# Altium schematic sheet Block digram.SchDoc: Block diagram
size A4; Date: 3-7-2020; Author: Tim Chien; DrawnBy: Tim Chien; DocumentNumber: 1; Revision: 1-1; SheetNumber: 1; SheetTotal: 6; Time: 23:47
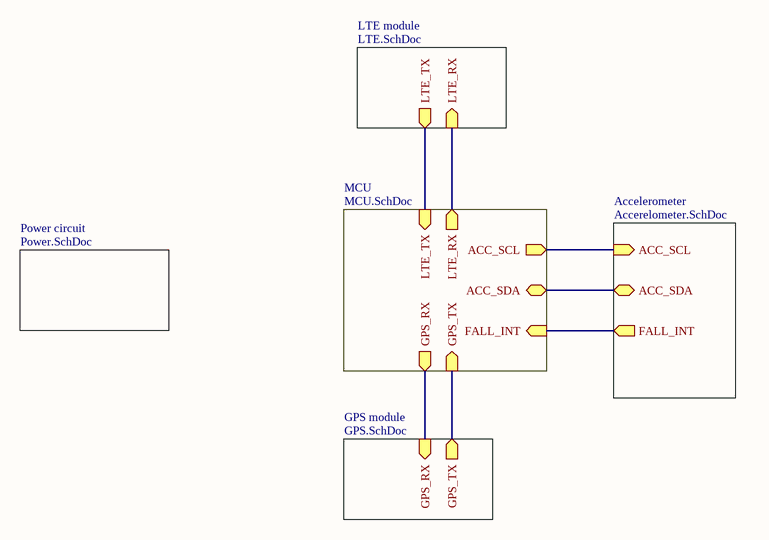
[diagram p0: Block digram.SchDoc]

## Sub-sheets
Accelerometer = Accerelometer.SchDoc: ACC_SCL (in), ACC_SDA (bidir), FALL_INT (out)
GPS module = GPS.SchDoc: GPS_TX (out), GPS_RX (in)
LTE module = LTE.SchDoc: LTE_TX (out), LTE_RX (in)
MCU = MCU.SchDoc: GPS_RX (out), GPS_TX (in), ACC_SCL (out), ACC_SDA (bidir), FALL_INT (in), LTE_TX (in), LTE_RX (out)
Power circuit = Power.SchDoc: no entries

## Nets
(unnamed): sheet Accelerometer/ACC_SCL, sheet MCU/ACC_SCL
(unnamed): sheet Accelerometer/ACC_SDA, sheet MCU/ACC_SDA
(unnamed): sheet Accelerometer/FALL_INT, sheet MCU/FALL_INT
(unnamed): sheet GPS module/GPS_TX, sheet MCU/GPS_TX
(unnamed): sheet GPS module/GPS_RX, sheet MCU/GPS_RX
(unnamed): sheet LTE module/LTE_TX, sheet MCU/LTE_TX
(unnamed): sheet LTE module/LTE_RX, sheet MCU/LTE_RX

## Notes on the sheet
- Title
- Size:
- Date:
- A4
- Number:
- Time:
- Revision:
- Sheet
- of
- File: